# Altium schematic sheet XC Tail Lights.SchDoc
size A4
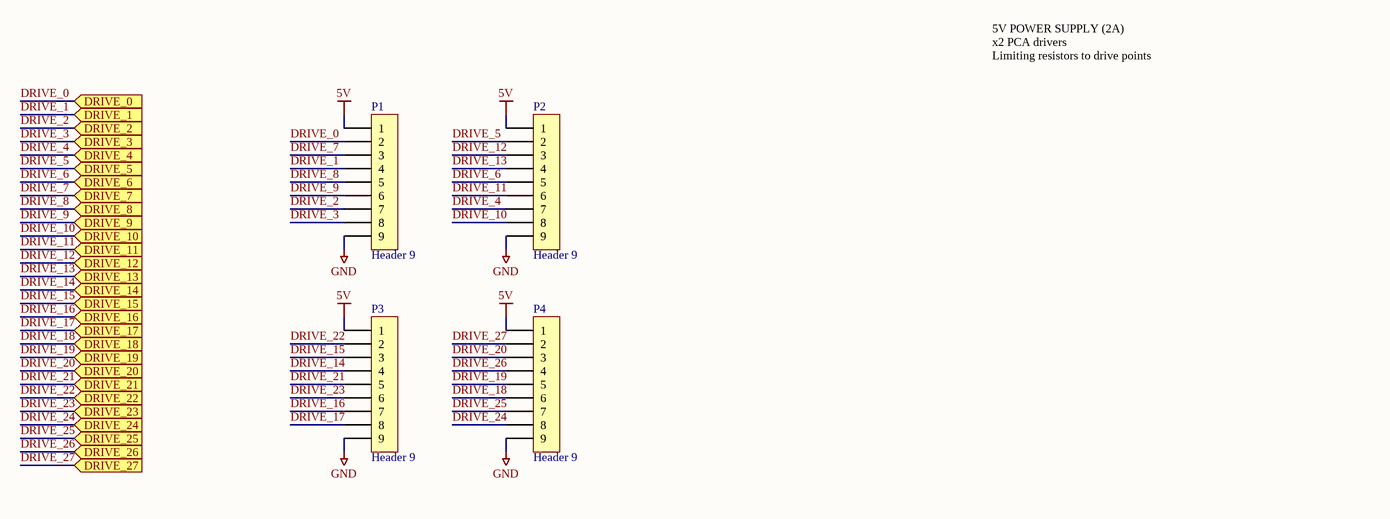
[diagram p0: XC Tail Lights.SchDoc]

## Parts
P1  Header 9  [HEADER 1x9]
P2  Header 9  [HEADER 1x9]
P3  Header 9  [HEADER 1x9]
P4  Header 9  [HEADER 1x9]

## Ports
DRIVE_0 (in), DRIVE_1 (in), DRIVE_2 (in), DRIVE_3 (in), DRIVE_4 (in), DRIVE_5 (in), DRIVE_6 (in), DRIVE_7 (in), DRIVE_8 (in), DRIVE_9 (in), DRIVE_10 (in), DRIVE_11 (in), DRIVE_12 (in), DRIVE_13 (in), DRIVE_14 (in), DRIVE_15 (in), DRIVE_16 (in), DRIVE_17 (in), DRIVE_18 (in), DRIVE_19 (in), DRIVE_20 (in), DRIVE_21 (in), DRIVE_22 (in), DRIVE_23 (in), DRIVE_24 (in), DRIVE_25 (in), DRIVE_26 (in), DRIVE_27 (in)

## Nets
5V: P1.1 P2.1 P3.1 P4.1
GND: P1.9 P2.9 P3.9 P4.9
DRIVE_0: P1.2 ; port DRIVE_0
DRIVE_1: P1.4 ; port DRIVE_1
DRIVE_2: P1.7 ; port DRIVE_2
DRIVE_3: P1.8 ; port DRIVE_3
DRIVE_4: P2.7 ; port DRIVE_4
DRIVE_5: P2.2 ; port DRIVE_5
DRIVE_6: P2.5 ; port DRIVE_6
DRIVE_7: P1.3 ; port DRIVE_7
DRIVE_8: P1.5 ; port DRIVE_8
DRIVE_9: P1.6 ; port DRIVE_9
DRIVE_10: P2.8 ; port DRIVE_10
DRIVE_11: P2.6 ; port DRIVE_11
DRIVE_12: P2.3 ; port DRIVE_12
DRIVE_13: P2.4 ; port DRIVE_13
DRIVE_14: P3.4 ; port DRIVE_14
DRIVE_15: P3.3 ; port DRIVE_15
DRIVE_16: P3.7 ; port DRIVE_16
DRIVE_17: P3.8 ; port DRIVE_17
DRIVE_18: P4.6 ; port DRIVE_18
DRIVE_19: P4.5 ; port DRIVE_19
DRIVE_20: P4.3 ; port DRIVE_20
DRIVE_21: P3.5 ; port DRIVE_21
DRIVE_22: P3.2 ; port DRIVE_22
DRIVE_23: P3.6 ; port DRIVE_23
DRIVE_24: P4.8 ; port DRIVE_24
DRIVE_25: P4.7 ; port DRIVE_25
DRIVE_26: P4.4 ; port DRIVE_26
DRIVE_27: P4.2 ; port DRIVE_27

## Notes on the sheet
- 5V POWER SUPPLY (2A)
  x2 PCA drivers
  Limiting resistors to drive points

## Library data of the parts
P1-P4 = Header 9: Header, 9-Pin; LatestRevisionDate: 17-Jul-2002; LatestRevisionNote: Re-released for DXP Platform.; Publisher: Altium Limited